# Altium schematic sheet LIPO_CHARGING.SchDoc
size A4
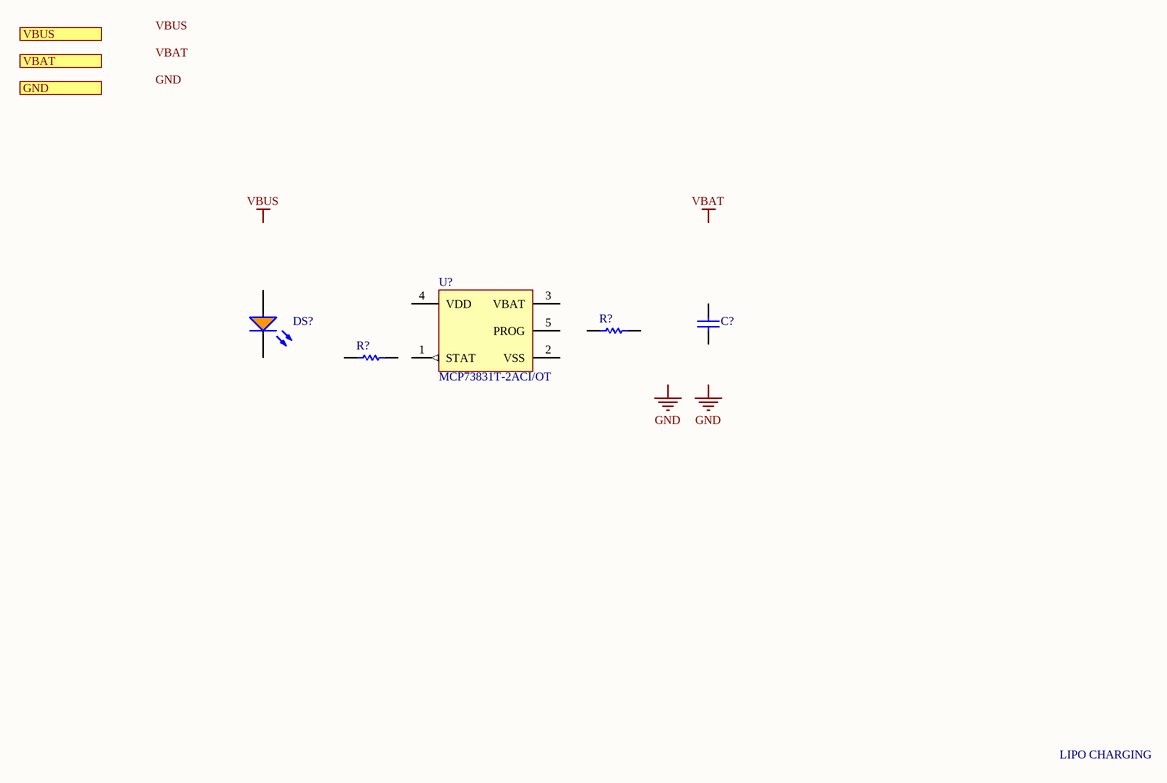
[diagram p0: LIPO_CHARGING.SchDoc]

## Parts
(Parts that share a designator on the sheet are numbered #1, #2 ... from top to bottom, then left to right.)
C?  GRM21BR61A106KE19L  [MURA-0805_H_1.35_M]  (value not drawn)
DS?  HSMD-C190  [AVAG-HSMX-C190_V]  (value not drawn)
R?#1  CRCW12064K70FKEA  [RESC3216X60X45ML15T20]  (value not drawn)
R?#2  CRCW08051K00FKEA  [RESC2013X50X30NL20T20]  (value not drawn)
U?  MCP73831T-2ACI/OT  [SOT-23-OT5_M]

## Ports
GND, VBAT, VBUS

## Nets

Not connected (* = marked no-connect by the designer): C? 1 2; DS? 1(A) 2(K); R?#1 1 2; R?#2 1 2; U? 1(STAT) 2(VSS) 3(VBAT) 4(VDD) 5(PROG)

## Notes on the sheet
- LIPO CHARGING
- Labels drawn without touching a wire or pin: GND, VBAT, VBUS

## Library data of the parts
C? = CMP-2000-05254-1: CAP, Ceramic, 10 uF, 10%, 10 V, 0805, RoHS, Tape and Reel; Manufacturer: Murata; Voltage - Rated: 10V; Product Training Modules: High-CapMultilayerCeramicCapacitors; Catalog Drawings: GRMSeries_0805_1.25; Temperature Coefficient: X5R; Online Catalog: GRMSeries; Featured Product: GA3SafetyRecognizedCapsandHi-CapMLCC; Capacitance: 10µF; Other Names: 490-1709-6; Applications: GeneralPurpose; Category: Capacitors; Datasheet Version: Aug-14; Datasheet URL: https://datasheet.ciiva.com/3777/210grm21br61a106ke1923-3777175.pdf; Ratings: -; Height - Seated (Max): -; Lead Spacing: -; Operating Temperature: -55degC~85degC; Features: -; Package Description: 2-Pin Surface Mount Device (0805), Body 2.1 x 1.35 mm; Standard Package: 1; Mounting Type: SurfaceMount,MLCC; Package Reference: 805; Tolerance: ±10%; Manufacturer URL: http://www.murata.com/; Size / Dimension: 0.079"Lx0.049"W(2.00mmx1.25mm); Packaging: Digi-Reel; Thickness (Max): 0.053"(1.35mm); Package / Case: 0805(2012Metric); Family: CeramicCapacitors; Series: GRM; Lead Style: -
DS? = CMP-1744-00006-1: LED Uni-Color Orange, 52 mW, 20 mA, -40 to 85 degC, 2-Pin SMD, RoHS, Tape and Reel; ComponentLink2Description: Datasheet; RoHSCompliant: True; ComponentLink3URL: http://www.fairchildsemi.com/dwg/MA/MA03D.pdf; Package Quantity: 100; Max Operating Temperature: 225degC; Min Operating Temperature: -40degC; ComponentLink2URL: http://docs.avagotech.com/docs/AV02-0551EN; PackageDescription: 2-Pin Surface Mount Device, Body 1.6 x 0.8 mm, Height 0.9 mm; DatasheetVersion: Mar-12; PackageReference: HSMX-C190; ComponentLink1URL: http://www.avagotech.com/; ComponentLink3Description: Package Specification; ComponentLink1Description: Manufacturer URL
R?#1 = CMP-2100-03618-1: Chip Resistor, 4.7 KOhm, +/- 1%, 0.25 W, -55 to 155 degC, 1206 (3216 Metric), RoHS, Tape and Reel; Manufacturer: Vishay Semiconductor; Power Rating: 250mW; Voltage Rating: 200V; Temperature Coefficient: 100ppm/degreesC; Package Quantity: 10; Composition: ThickFilm; REACH SVHC: Unknown; Mount: SurfaceMount; Max Operating Temperature: 155degC; Length: 3.2mm; Number of Terminations: 2; Case Code (Metric): 3216; Military Standard: Not; Width: 1.6mm; Datasheet Version: 41061.0; Max Power Dissipation: 250mW; Datasheet URL: http://www.vishay.com/docs/20035/dcrcwe3.pdf; Contact Plating: Tin; Case/Package: 1206; Height: 0.55mm; Package Reference: 1206.0; Lead Free: LeadFree; Weight: 0.000353oz; Package Description: 2-Pin Surface Mount Device, Body 3.15 x 1.6 mm; Min Operating Temperature: -55degC; Resistance: 4.7KOhm; Packaging: TapeandReel; Depth: 1.6mm; Tolerance: 1%; RoHSCompliant: true; Termination: SMD/SMT; Case Code (Imperial): 1206; Voltage Rating (DC): 200V; Radiation Hardening: No; Manufacturer URL: http://www.vishay.com/
R?#2 = CMP-2001-03595-1: Manufacturer: Vishay Dale; Part Number: CRCW08051K00FKEA
U? = CMP-0133-00143-1: Miniature Single-Cell, Fully Integrated Li-Ion, Li-Polymer Charge Management Controller, 4.2V, 5-Pin SOT-23, Industrial Temperature, Tape and Reel; PackageReference: SOT-23-OT5; PackageDescription: 5-Lead Plastic Small Outline Transistor (OT) [SOT-23]; PackageVersion: revBB, Aug-2009; DatasheetVersion: revE, Sep-2008; Code_IPC: SOT23-5